# Altium schematic sheet bone_capes.SchDoc
size A4
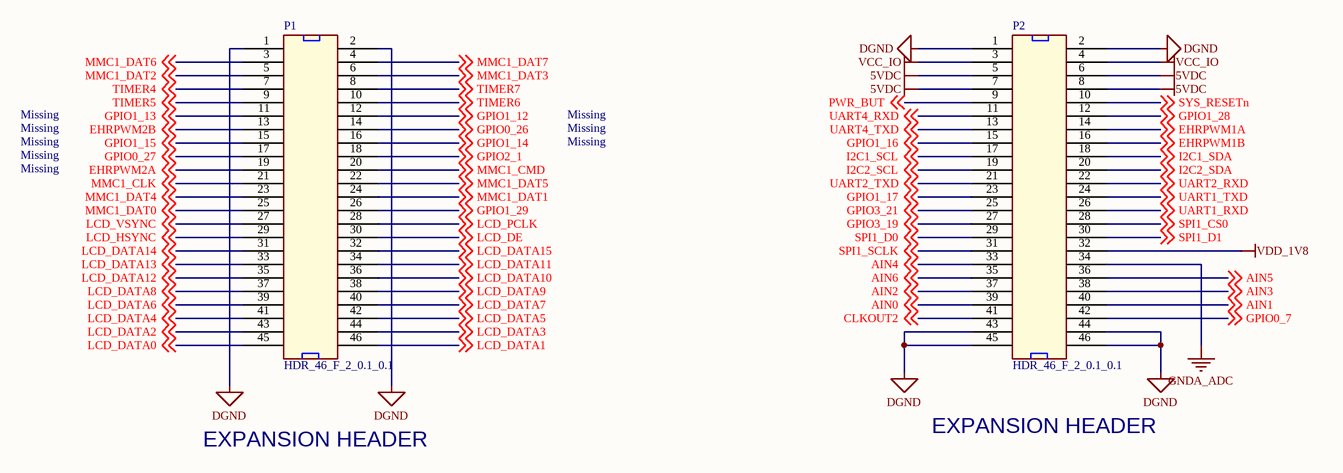
[diagram p0: bone_capes.SchDoc]

## Parts
P1  HDR_46_F_2_0.1_0.1  [DIP46]
P2  HDR_46_F_2_0.1_0.1  [DIP46]

## Nets
5VDC: P2.5 P2.6 P2.7 P2.8
DGND: P1.1 P1.2 P2.1 P2.2 P2.43 P2.44 P2.45 P2.46
GNDA_ADC: P2.34
VCC_IO: P2.3 P2.4
VDD_1V8: P2.32
AIN0: P2.39 ; off-sheet AIN0
AIN1: P2.40 ; off-sheet AIN1
AIN2: P2.37 ; off-sheet AIN2
AIN3: P2.38 ; off-sheet AIN3
AIN4: P2.33 ; off-sheet AIN4
AIN5: P2.36 ; off-sheet AIN5
AIN6: P2.35 ; off-sheet AIN6
CLKOUT2: P2.41 ; off-sheet CLKOUT2
EHRPWM1A: P2.14 ; off-sheet EHRPWM1A
EHRPWM1B: P2.16 ; off-sheet EHRPWM1B
EHRPWM2A: P1.19 ; off-sheet EHRPWM2A
EHRPWM2B: P1.13 ; off-sheet EHRPWM2B
GPIO0_7: P2.42 ; off-sheet GPIO0_7
GPIO0_26: P1.14 ; off-sheet GPIO0_26
GPIO0_27: P1.17 ; off-sheet GPIO0_27
GPIO1_12: P1.12 ; off-sheet GPIO1_12
GPIO1_13: P1.11 ; off-sheet GPIO1_13
GPIO1_14: P1.16 ; off-sheet GPIO1_14
GPIO1_15: P1.15 ; off-sheet GPIO1_15
GPIO1_16: P2.15 ; off-sheet GPIO1_16
GPIO1_17: P2.23 ; off-sheet GPIO1_17
GPIO1_28: P2.12 ; off-sheet GPIO1_28
GPIO1_29: P1.26 ; off-sheet GPIO1_29
GPIO2_1: P1.18 ; off-sheet GPIO2_1
GPIO3_19: P2.27 ; off-sheet GPIO3_19
GPIO3_21: P2.25 ; off-sheet GPIO3_21
I2C1_SCL: P2.17 ; off-sheet I2C1_SCL
I2C1_SDA: P2.18 ; off-sheet I2C1_SDA
I2C2_SCL: P2.19 ; off-sheet I2C2_SCL
I2C2_SDA: P2.20 ; off-sheet I2C2_SDA
LCD_DATA0: P1.45 ; off-sheet LCD_DATA0
LCD_DATA1: P1.46 ; off-sheet LCD_DATA1
LCD_DATA2: P1.43 ; off-sheet LCD_DATA2
LCD_DATA3: P1.44 ; off-sheet LCD_DATA3
LCD_DATA4: P1.41 ; off-sheet LCD_DATA4
LCD_DATA5: P1.42 ; off-sheet LCD_DATA5
LCD_DATA6: P1.39 ; off-sheet LCD_DATA6
LCD_DATA7: P1.40 ; off-sheet LCD_DATA7
LCD_DATA8: P1.37 ; off-sheet LCD_DATA8
LCD_DATA9: P1.38 ; off-sheet LCD_DATA9
LCD_DATA10: P1.36 ; off-sheet LCD_DATA10
LCD_DATA11: P1.34 ; off-sheet LCD_DATA11
LCD_DATA12: P1.35 ; off-sheet LCD_DATA12
LCD_DATA13: P1.33 ; off-sheet LCD_DATA13
LCD_DATA14: P1.31 ; off-sheet LCD_DATA14
LCD_DATA15: P1.32 ; off-sheet LCD_DATA15
LCD_DE: P1.30 ; off-sheet LCD_DE
LCD_HSYNC: P1.29 ; off-sheet LCD_HSYNC
LCD_PCLK: P1.28 ; off-sheet LCD_PCLK
LCD_VSYNC: P1.27 ; off-sheet LCD_VSYNC
MMC1_CLK: P1.21 ; off-sheet MMC1_CLK
MMC1_CMD: P1.20 ; off-sheet MMC1_CMD
MMC1_DAT0: P1.25 ; off-sheet MMC1_DAT0
MMC1_DAT1: P1.24 ; off-sheet MMC1_DAT1
MMC1_DAT2: P1.5 ; off-sheet MMC1_DAT2
MMC1_DAT3: P1.6 ; off-sheet MMC1_DAT3
MMC1_DAT4: P1.23 ; off-sheet MMC1_DAT4
MMC1_DAT5: P1.22 ; off-sheet MMC1_DAT5
MMC1_DAT6: P1.3 ; off-sheet MMC1_DAT6
MMC1_DAT7: P1.4 ; off-sheet MMC1_DAT7
PWR_BUT: P2.9 ; off-sheet PWR_BUT
SPI1_CS0: P2.28 ; off-sheet SPI1_CS0
SPI1_D0: P2.29 ; off-sheet SPI1_D0
SPI1_D1: P2.30 ; off-sheet SPI1_D1
SPI1_SCLK: P2.31 ; off-sheet SPI1_SCLK
SYS_RESETn: P2.10 ; off-sheet SYS_RESETn
TIMER4: P1.7 ; off-sheet TIMER4
TIMER5: P1.9 ; off-sheet TIMER5
TIMER6: P1.10 ; off-sheet TIMER6
TIMER7: P1.8 ; off-sheet TIMER7
UART1_RXD: P2.26 ; off-sheet UART1_RXD
UART1_TXD: P2.24 ; off-sheet UART1_TXD
UART2_RXD: P2.22 ; off-sheet UART2_RXD
UART2_TXD: P2.21 ; off-sheet UART2_TXD
UART4_RXD: P2.11 ; off-sheet UART4_RXD
UART4_TXD: P2.13 ; off-sheet UART4_TXD

## Notes on the sheet
- Missing
- EXPANSION HEADER

## Library data of the parts
P1 P2 = HDR_46_F_2_0.1_0.1: NN HEADER FMAL 46PS.1" DL GOLD; Mfr: major league electronics; P/N: SSHS-123-D-02-GT-LF